# EAGLE design jack10_breakout (EAGLE 9.6.0)
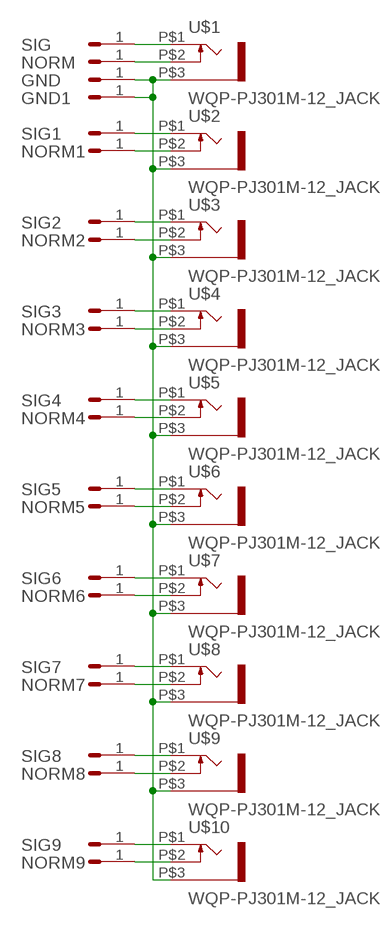
[diagram p0: schematic, sheet 1]

## Parts
GND  HEADER/MALE/01  [HEADER/MALE/01]
GND1  HEADER/MALE/01  [HEADER/MALE/01]
NORM  HEADER/MALE/01  [HEADER/MALE/01]
NORM1  HEADER/MALE/01  [HEADER/MALE/01]
NORM2  HEADER/MALE/01  [HEADER/MALE/01]
NORM3  HEADER/MALE/01  [HEADER/MALE/01]
NORM4  HEADER/MALE/01  [HEADER/MALE/01]
NORM5  HEADER/MALE/01  [HEADER/MALE/01]
NORM6  HEADER/MALE/01  [HEADER/MALE/01]
NORM7  HEADER/MALE/01  [HEADER/MALE/01]
NORM8  HEADER/MALE/01  [HEADER/MALE/01]
NORM9  HEADER/MALE/01  [HEADER/MALE/01]
SIG  HEADER/MALE/01  [HEADER/MALE/01]
SIG1  HEADER/MALE/01  [HEADER/MALE/01]
SIG2  HEADER/MALE/01  [HEADER/MALE/01]
SIG3  HEADER/MALE/01  [HEADER/MALE/01]
SIG4  HEADER/MALE/01  [HEADER/MALE/01]
SIG5  HEADER/MALE/01  [HEADER/MALE/01]
SIG6  HEADER/MALE/01  [HEADER/MALE/01]
SIG7  HEADER/MALE/01  [HEADER/MALE/01]
SIG8  HEADER/MALE/01  [HEADER/MALE/01]
SIG9  HEADER/MALE/01  [HEADER/MALE/01]
U$1  WQP-PJ301M-12_JACK  [WQP-PJ301M-12_JACK]
U$2  WQP-PJ301M-12_JACK  [WQP-PJ301M-12_JACK]
U$3  WQP-PJ301M-12_JACK  [WQP-PJ301M-12_JACK]
U$4  WQP-PJ301M-12_JACK  [WQP-PJ301M-12_JACK]
U$5  WQP-PJ301M-12_JACK  [WQP-PJ301M-12_JACK]
U$6  WQP-PJ301M-12_JACK  [WQP-PJ301M-12_JACK]
U$7  WQP-PJ301M-12_JACK  [WQP-PJ301M-12_JACK]
U$8  WQP-PJ301M-12_JACK  [WQP-PJ301M-12_JACK]
U$9  WQP-PJ301M-12_JACK  [WQP-PJ301M-12_JACK]
U$10  WQP-PJ301M-12_JACK  [WQP-PJ301M-12_JACK]

## Nets
N$1: SIG.1 U$1.P$1
N$2: NORM.1 U$1.P$2
N$4: SIG1.1 U$2.P$1
N$5: NORM1.1 U$2.P$2
N$7: SIG2.1 U$3.P$1
N$8: NORM2.1 U$3.P$2
N$10: SIG3.1 U$4.P$1
N$11: NORM3.1 U$4.P$2
N$12: GND1.1 GND.1 U$1.P$3 U$2.P$3 U$3.P$3 U$4.P$3 U$5.P$3 U$6.P$3 U$7.P$3 U$8.P$3 U$9.P$3 U$10.P$3
N$13: SIG4.1 U$5.P$1
N$14: NORM4.1 U$5.P$2
N$16: SIG5.1 U$6.P$1
N$17: NORM5.1 U$6.P$2
N$19: SIG6.1 U$7.P$1
N$20: NORM6.1 U$7.P$2
N$22: SIG7.1 U$8.P$1
N$23: NORM7.1 U$8.P$2
N$25: SIG8.1 U$9.P$1
N$26: NORM8.1 U$9.P$2
N$28: SIG9.1 U$10.P$1
N$29: NORM9.1 U$10.P$2

## Library data of the parts
GND GND1 NORM NORM1-NORM9 SIG SIG1-SIG9 = connectors:HEADER/MALE/01
U$1-U$10 = controls:WQP-PJ301M-12_JACK

## Board
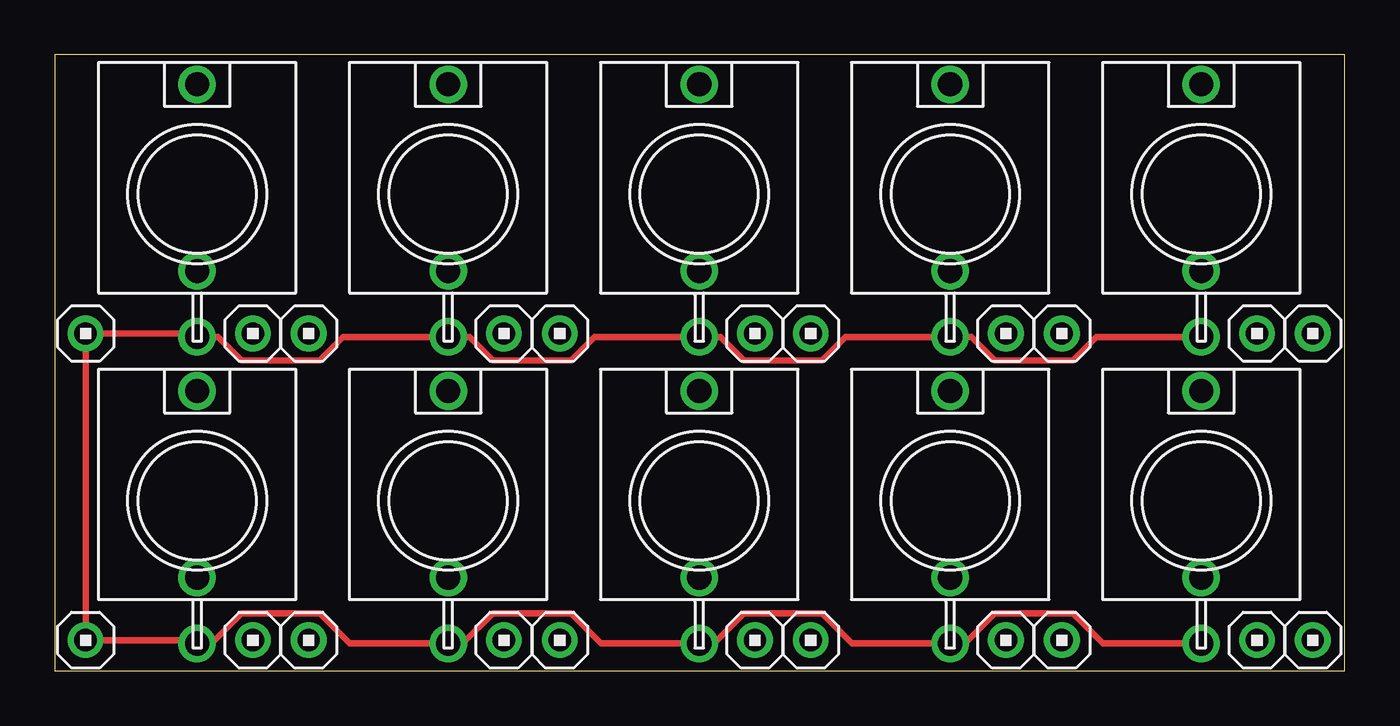
[diagram p1: board, top side]
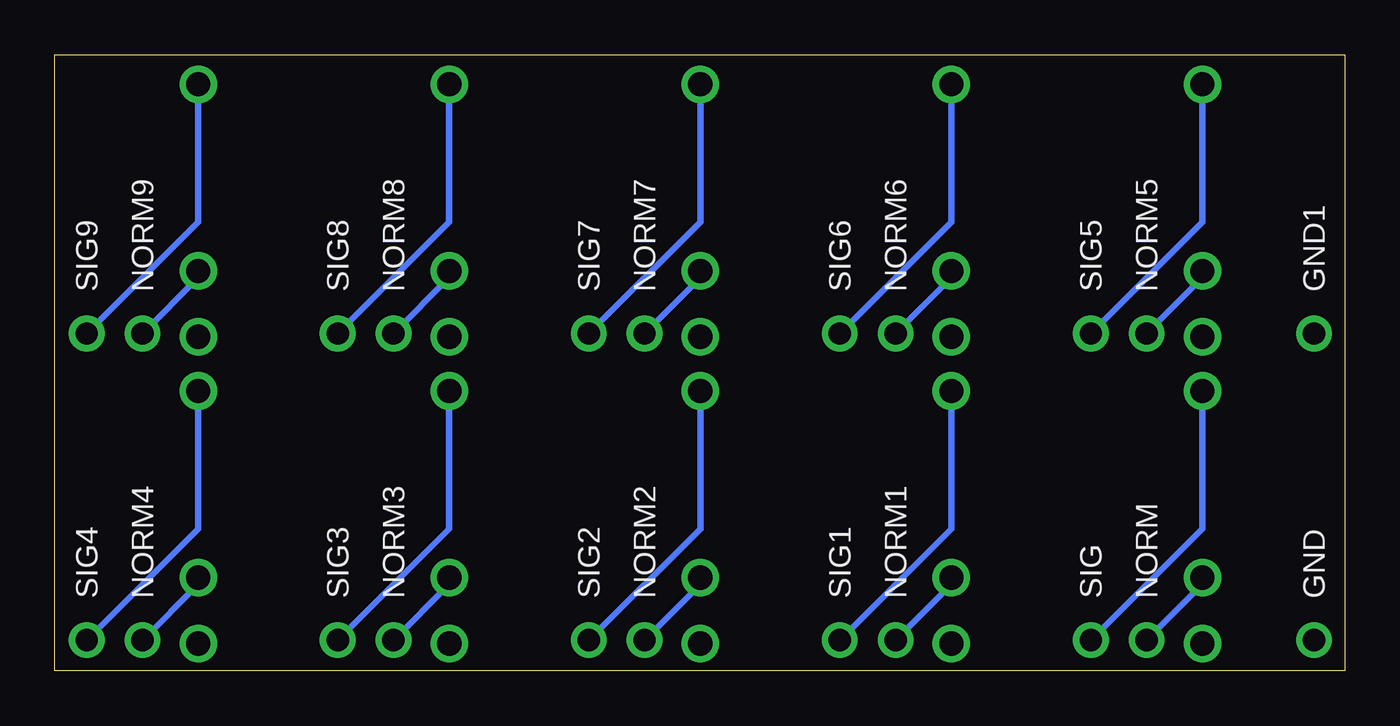
[diagram p2: board, bottom side, seen from below]

Size 58.73 x 28.06 mm. Coordinates in mm from the lower left corner, seen from the top.
Outline: 0,0 58.73,0 58.73,28.06 0,28.06 0,0
Copper layers (1*16): Top 0.0356mm / dielectric 1.5011mm / Bottom 0.0356mm
Design rules "pigatron": minimum track width 12mil, minimum drill 13mil, track to track 15mil, track to pad 10mil, pad to pad 10mil, via to via 10mil, smd to smd 6mil, copper to edge 15mil, drill to drill 10mil, minimum pad ring 12mil, minimum via ring 10mil, stop-mask expansion 4mil, vias tented up to drill 0mil, thermal gap 10mil

### Footprints (pad centres in the part's own frame; a part is rotated, then mirrored left to right if it is on the bottom)
HEADER/MALE/01 = drill 1.016: 1 0,0
WQP-PJ301M-12_JACK = drill 1.1: P$1 0,5; P$2 0,-3.5; P$3 0,-6.5

### Placement (x,y rotation side)
GND  1.4,1.4 90 top
GND1  1.4,15.37 90 top
NORM  9.02,1.4 90 top
NORM1  20.45,1.4 90 top
NORM2  31.88,1.4 90 top
NORM3  43.31,1.4 90 top
NORM4  54.74,1.4 90 top
NORM5  9.02,15.37 90 top
NORM6  20.45,15.37 90 top
NORM7  31.88,15.37 90 top
NORM8  43.31,15.37 90 top
NORM9  54.74,15.37 90 top
SIG  11.56,1.4 90 top
SIG1  22.99,1.4 90 top
SIG2  34.42,1.4 90 top
SIG3  45.85,1.4 90 top
SIG4  57.28,1.4 90 top
SIG5  11.56,15.37 90 top
SIG6  22.99,15.37 90 top
SIG7  34.42,15.37 90 top
SIG8  45.85,15.37 90 top
SIG9  57.28,15.37 90 top
U$1  6.48,7.75 0 top
U$2  17.91,7.75 0 top
U$3  29.34,7.75 0 top
U$4  40.77,7.75 0 top
U$5  52.2,7.75 0 top
U$6  6.48,21.72 0 top
U$7  17.91,21.72 0 top
U$8  29.34,21.72 0 top
U$9  40.77,21.72 0 top
U$10  52.2,21.72 0 top

### Tracks (layer width: path | path; a pad name or v marks a point on that pad's centre or on a via)
N$1
  Bottom 0.305: SIG.1 6.48,6.48 U$1.P$1
N$2
  Bottom 0.305: NORM.1 6.48,3.94 U$1.P$2
N$4
  Bottom 0.305: SIG1.1 17.91,6.48 U$2.P$1
N$5
  Bottom 0.305: NORM1.1 17.91,3.94 U$2.P$2
N$7
  Bottom 0.305: SIG2.1 29.34,6.48 U$3.P$1
N$8
  Bottom 0.305: NORM2.1 29.34,3.94 U$3.P$2
N$10
  Bottom 0.305: SIG3.1 40.77,6.48 U$4.P$1
N$11
  Bottom 0.305: NORM3.1 40.77,3.94 U$4.P$2
N$12
  Top 0.305: U$10.P$3 47.42,15.22 46.35,14.15 42.8,14.15 41.73,15.22 U$9.P$3 35.99,15.22 34.92,14.15 31.37,14.15 30.3,15.22 U$8.P$3 24.56,15.22 23.49,14.15 19.94,14.15 18.87,15.22 U$7.P$3 13.13,15.22 12.06,14.15 8.51,14.15 7.44,15.22 U$6.P$3 6.33,15.37 GND1.1 GND.1 6.33,1.4 U$1.P$3 7.14,1.25 8.51,2.62 12.06,2.62 13.43,1.25 U$2.P$3 18.57,1.25 19.94,2.62 23.49,2.62 24.86,1.25 U$3.P$3 30,1.25 31.37,2.62 34.92,2.62 36.29,1.25 U$4.P$3 41.43,1.25 42.8,2.62 46.35,2.62 47.72,1.25 U$5.P$3
N$13
  Bottom 0.305: SIG4.1 52.2,6.48 U$5.P$1
N$14
  Bottom 0.305: NORM4.1 52.2,3.94 U$5.P$2
N$16
  Bottom 0.305: SIG5.1 6.48,20.45 U$6.P$1
N$17
  Bottom 0.305: NORM5.1 6.48,17.91 U$6.P$2
N$19
  Bottom 0.305: SIG6.1 17.91,20.45 U$7.P$1
N$20
  Bottom 0.305: NORM6.1 17.91,17.91 U$7.P$2
N$22
  Bottom 0.305: SIG7.1 29.34,20.45 U$8.P$1
N$23
  Bottom 0.305: NORM7.1 29.34,17.91 U$8.P$2
N$25
  Bottom 0.305: SIG8.1 40.77,20.45 U$9.P$1
N$26
  Bottom 0.305: NORM8.1 40.77,17.91 U$9.P$2
N$28
  Bottom 0.305: SIG9.1 52.2,20.45 U$10.P$1
N$29
  Bottom 0.305: NORM9.1 52.2,17.91 U$10.P$2